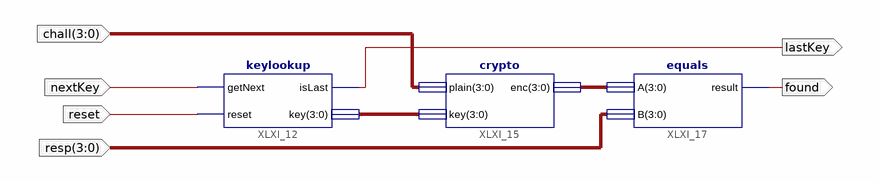
[diagram p0: schematic sheet 1]
// Xilinx ISE schematic checker.sch (xc9500xl) as structural Verilog: 3 symbols, 6 ports
module \checker  (
  input  [3:0] resp,
  input  [3:0] chall,
  input  nextKey,
  input  reset,
  output lastKey,
  output found
);

  wire [3:0] XLXN_23, XLXN_31;

  keylookup XLXI_12 (.getNext(nextKey), .reset(reset), .isLast(lastKey), .key(XLXN_31));
  crypto XLXI_15 (.plain(chall), .key(XLXN_31), .enc(XLXN_23));
  equals XLXI_17 (.A(XLXN_23), .B(resp), .result(found));
endmodule
